# EAGLE schematic V6.0 Wiring (EAGLE 7.6.0)
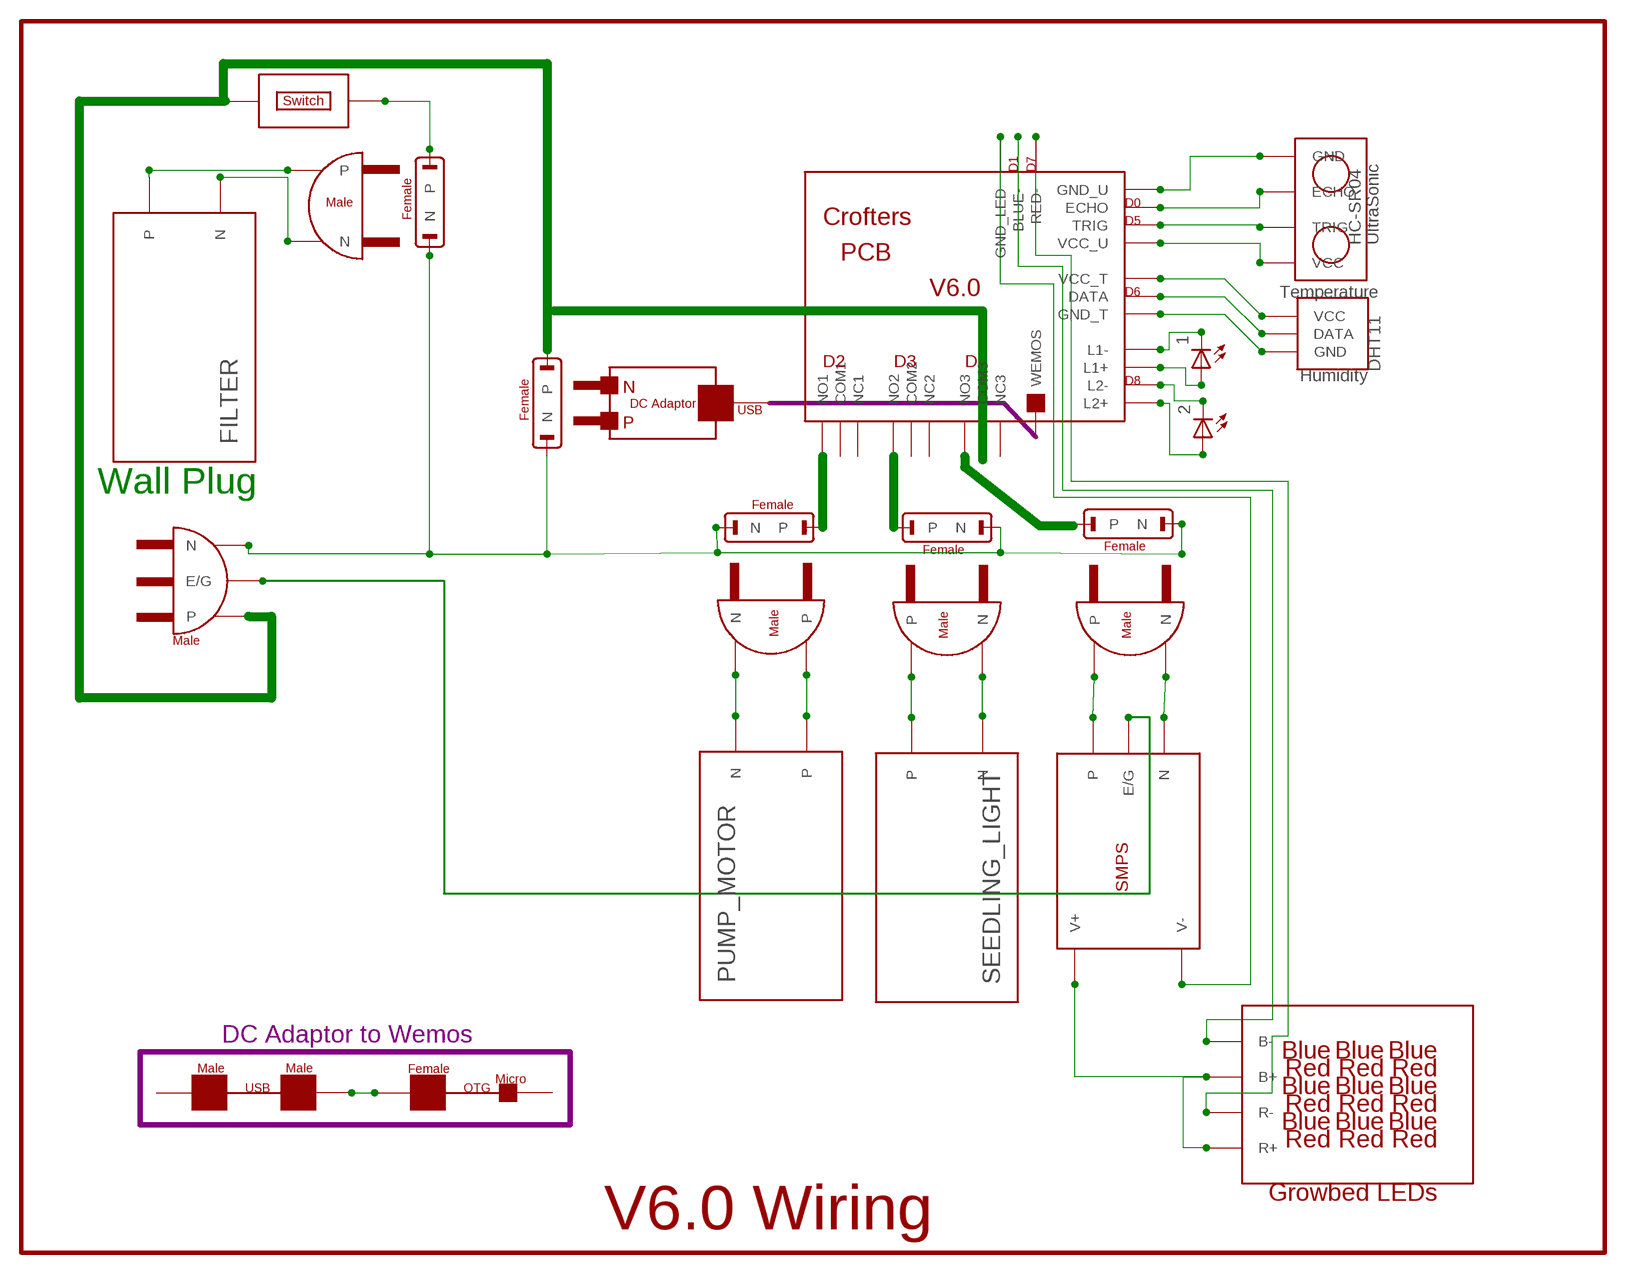
[diagram p0: schematic, sheet 1]

## Parts
1  LED5MM  [LED5MM]
2  LED5MM  [LED5MM]
FILTER  EQUIPMENT  [2PINS]
PUMP_MOTOR  EQUIPMENT  [2PINS]
SEEDLING_LIGHT  EQUIPMENT  [2PINS]
U$1  AC-PLUG-3  [3PINS]
U$2  AC-PLUG-2  [2PINS]
U$3  AC-PLUG-2  [2PINS]
U$4  AC-PLUG-2  [2PINS]
U$5  AC-PLUG-2  [2PINS]
U$6  DC_ADAPTOR  [1PIN]
U$7  V6.0  [V6.0]
U$8  USONIC  [4PINS]
U$9  M2M_USB  [2PINS]
U$10  GROWBED_LEDS  [4PINS]
U$11  OTG  [2PINS]
U$12  DHT11  [3PINS]
U$13  SWITCH  [2PINS]
U$15  SMPS  [5PINS]
X1  AC-JACK-2  [2PINS]
X2  AC-JACK-2  [2PINS]
X3  AC-JACK-2  [2PINS]
X4  AC-JACK-2  [2PINS]
X5  AC-JACK-2  [2PINS]

## Nets
N$1: U$13.1 X5.1(P)
N$2: U$1.2(P) U$13.2
N$4: U$7.P$17(NO1) X3.1(P)
N$5: U$7.P$18(NO2)
N$6: U$1.3(N) X1.2(N) X2.2(N) X3.2(N) X4.2(N) X5.2(N)
N$7: SEEDLING_LIGHT.1(P) U$5.1(P)
N$8: SEEDLING_LIGHT.2(N) U$5.2(N)
N$9: FILTER.1(P) U$2.1(P)
N$10: FILTER.2(N) U$2.2(N)
N$11: U$3.1(P) U$15.P$3(P)
N$12: U$3.2(N) U$15.P$2(N)
N$13: U$15.P$1(E/G)
N$14: U$10.P$1(B+) U$10.P$3(R+) U$15.P$4(V+)
N$15: U$7.P$23(VCC_U) U$8.P$4(VCC)
N$16: PUMP_MOTOR.1(P) U$4.1(P)
N$17: PUMP_MOTOR.2(N) U$4.2(N)
N$18: U$7.P$19(NO3)
N$19: U$7.P$21(TRIG) U$8.P$3(TRIG)
N$20: U$7.P$6(ECHO) U$8.P$1(ECHO)
N$21: U$7.P$9(GND_U) U$8.P$2(GND)
N$22: U$7.P$22(VCC_T) U$12.3(VCC)
N$23: U$7.P$5(DATA) U$12.1(DATA)
N$24: U$7.P$8(GND_T) U$12.2(GND)
N$25: U$15.P$5(V-)
N$26: U$9.2 U$11.1
N$27: U$7.P$1(BLUE-) U$10.P$2(B-)
N$28: U$7.P$20(RED-)
N$29: 2.A U$7.P$12(L2+)
N$30: 2.K(C) U$7.P$13(L2-)
N$31: 1.A U$7.P$10(L1+)
N$32: 1.K(C) U$7.P$11(L1-)
Unconnected: U$1.1(E/G) U$6.P$1 U$7.P$2(COM1) U$7.P$3(COM2) U$7.P$4(COM3) U$7.P$7(GND_LED) U$7.P$14(NC1) U$7.P$15(NC2) U$7.P$16(NC3) U$7.P$24(WEMOS) U$9.1 U$10.P$4(R-) U$11.2 X1.1(P) X2.1(P) X4.1(P)

## Notes on the sheet
- Wall Plug
- DC Adaptor to Wemos
- V6.0 Wiring

## Library data of the parts
1 2 = bt_opto:LED: LED Various packages
FILTER PUMP_MOTOR SEEDLING_LIGHT = Crofters:EQUIPMENT: Equipments Filter, Pump Motor, Seedling Light
U$1 = Crofters:AC-PLUG-3: AC Plug, 3-Pin Male
U$2-U$5 = Crofters:AC-PLUG-2: AC Plug, 2-Pin Male
U$6 = Crofters:DC_ADAPTOR: DC Adaptor 5v
U$7 = Crofters:V6.0: V6.0 Used for online systems.
U$8 = Crofters:USONIC: Ultasonic Sensor HC-SR04
U$9 = Crofters:M2M_USB: USB Cable Male USB to Male USB
U$10 = Crofters:GROWBED_LEDS: Growbed LEDs Red and Blue LED strips
U$11 = Crofters:OTG: OTG Cable MicroUSB to Female USB
U$12 = Crofters:DHT11: DHT11 Temperature and Humidity Sensor
U$13 = Crofters:SWITCH: Switch On-Off Switch
U$15 = Crofters:SMPS
X1-X5 = Crofters:AC-JACK-2: AC Jack, 2-Pin Female